# EAGLE design Grove  - Rotary Angle Sensor(P) v1.1 (EAGLE 6.3)
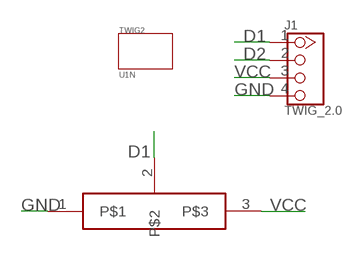
[diagram p0: schematic, sheet 1]

## Parts
J1  TWIG_2.0  [2.0_1X4]
TWIG2  U1N  [U1N]
U$1  ROTATION  [ROTATION]

## Nets
D1: J1.1 U$1.2
D2: J1.2
GND: J1.4 U$1.1
VCC: J1.3 U$1.3
Unconnected: U$1.4 U$1.5

## Library data of the parts
J1 = CONNECTER:TWIG_2.0
TWIG2 = twig_template1:U1N
U$1 = seeedleo:ROTATION

## Board
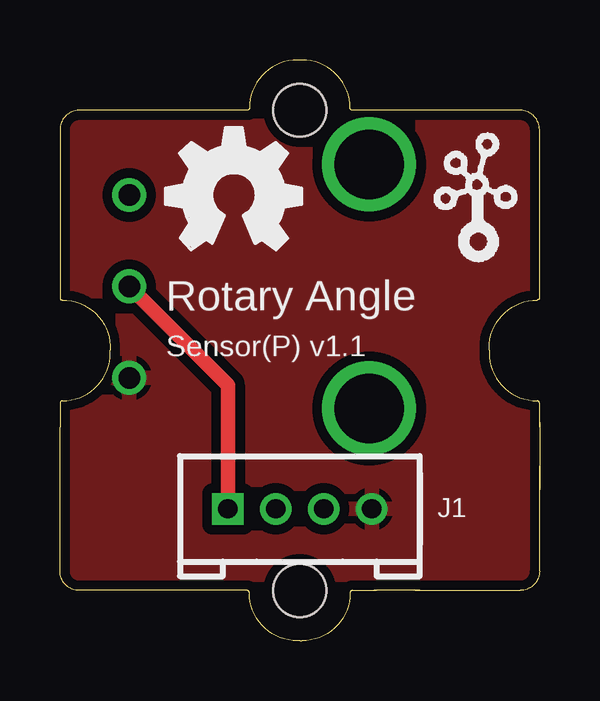
[diagram p1: board, top side]
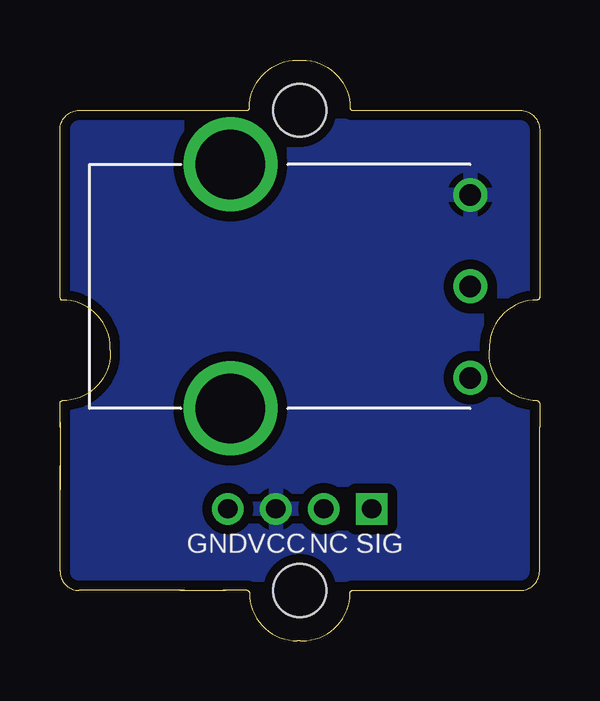
[diagram p2: board, bottom side, seen from below]

Size 20 x 24.2 mm. Coordinates in mm from the lower left corner, seen from the top.
Copper layers (1*16): Top 0.035mm / dielectric 1.5mm / Bottom 0.035mm
Design rules "default": minimum track width 6mil, minimum drill 12mil, track to track 6mil, track to pad 6mil, pad to pad 6mil, via to via 6mil, smd to smd 0mil, copper to edge 10mil, drill to drill 10mil, minimum pad ring 10mil, minimum via ring 6mil, stop-mask expansion 2mil, vias tented up to drill 100mil, thermal gap 10mil

### Footprints (pad centres in the part's own frame; a part is rotated, then mirrored left to right if it is on the bottom)
2.0_1X4 = drill 0.8 pad 1.27 square: 1 -3,0 | drill 0.8 pad 1.27: 2 -1,0; 3 1,0; 4 3,0
U1N = hole 2.2: 0,-10; 0,10
ROTATION = drill 0.9: 1 0,3.81; 2 0,0; 3 0,-3.81 | drill 2.9 pad 3.429: 4 10,5.08; 5 10,-5.08

### Placement (x,y rotation side)
J1  10,5.5 0 top
TWIG2  10,12.1 0 bottom
U$1  2.89,14.77 180 bottom
U$2  [TWIGLOGO_SMALL]  15.21,15.66 0 top
U$3  [OSHW_FILLX200_NOTEXT]  4.41,16.29 0 top

### Tracks (layer width: path | path; a pad name or v marks a point on that pad's centre or on a via)
D1
  Top 0.61: U$1.2 7,10.65 J1.1
GND
  pour Top (isolate 0.406): -2.45,25.05 22.45,25.05 22.45,-1.11 -2.45,-1.11
VCC
  pour Bottom (isolate 0.406): -2.7,25.05 22.45,25.05 22.45,-1.36 -2.7,-1.36

### Text on the board
tPlace: Rotary Angle | Sensor(P) v1.1
bPlace: SIG | NC | VCC | GND